# Altium schematic sheet FOTA MicroController Power Switch.SchDoc: FOTA MicroController Latched Power Trigger
size 292 x 193 mm; DocumentNumber: 44; SheetNumber: 32; SheetTotal: 42
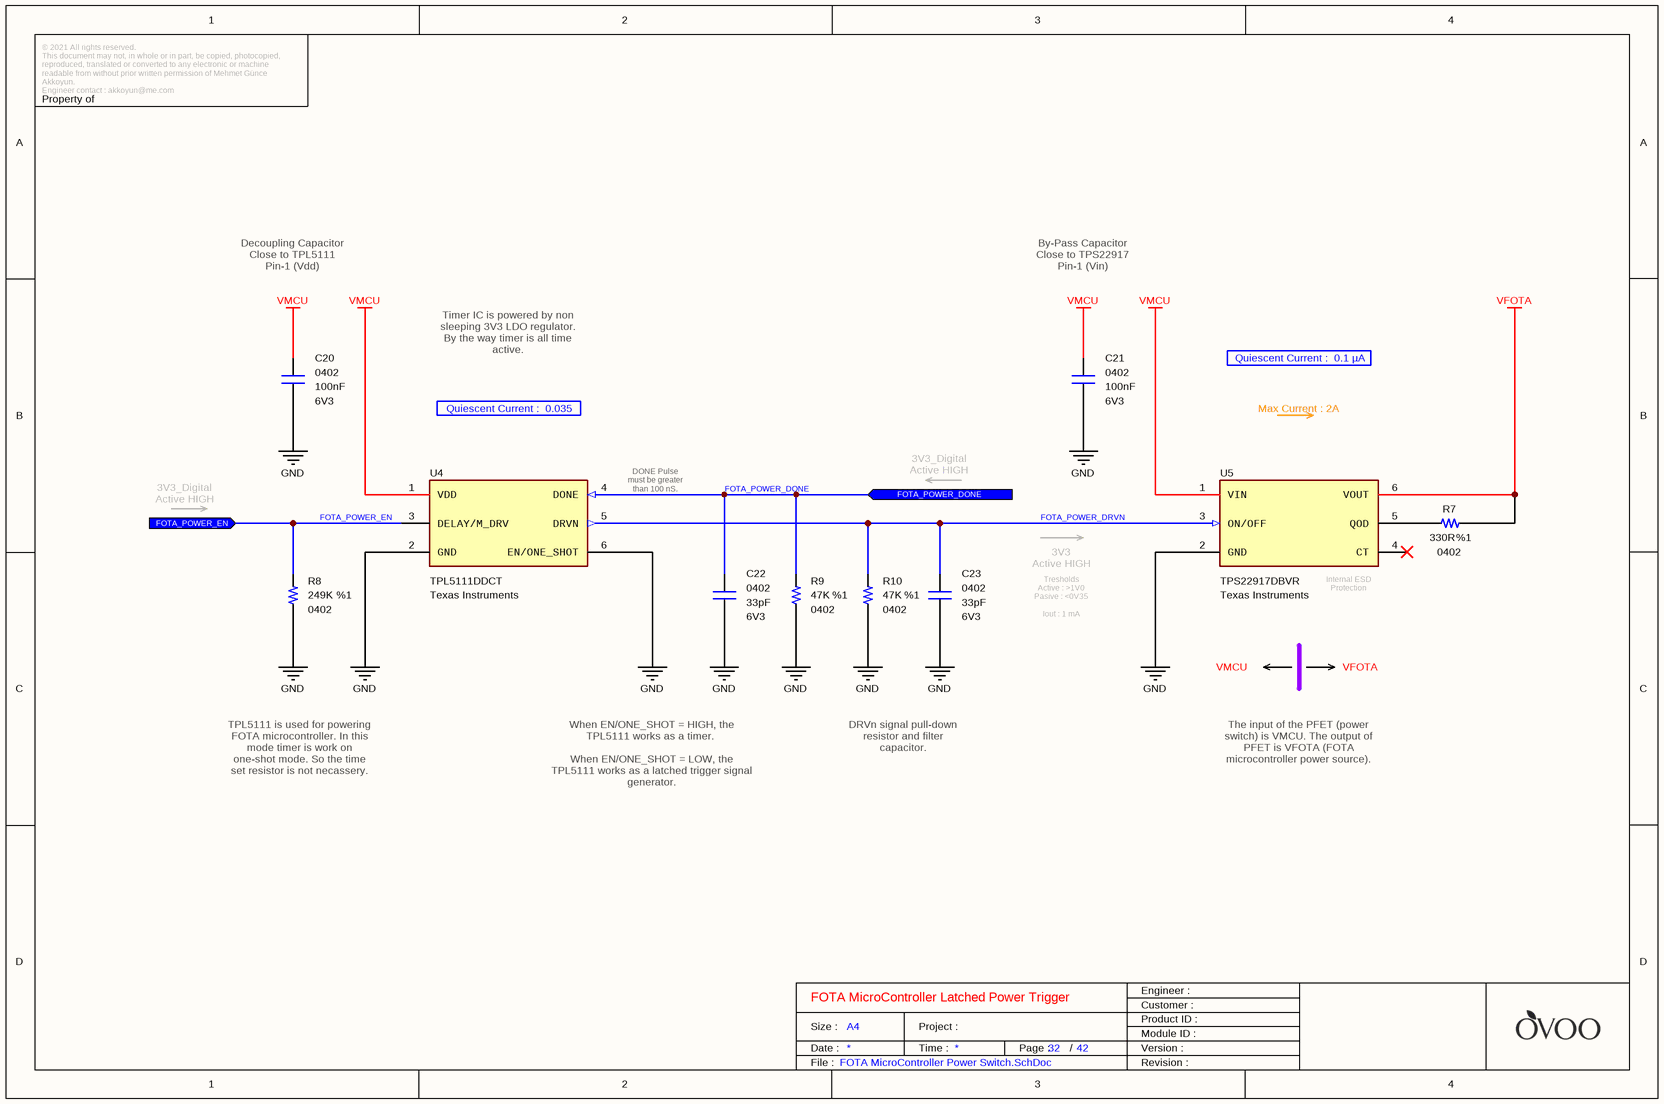
[diagram p0: FOTA MicroController Power Switch.SchDoc]

## Parts
C20  value 100nF  Case: 0402  Voltage: 6V3  [CAPACITOR_0402]  (hidden comment: Multilayer Ceramic Capacitor)
C21  value 100nF  Case: 0402  Voltage: 6V3  [CAPACITOR_0402]  (hidden comment: Multilayer Ceramic Capacitor)
C22  value 33pF  Case: 0402  Voltage: 6V3  [CAPACITOR_0402]  (hidden comment: Multilayer Ceramic Capacitor)
C23  value 33pF  Case: 0402  Voltage: 6V3  [CAPACITOR_0402]  (hidden comment: Multilayer Ceramic Capacitor)
R7  value 330R  Tolerance: %1  Case: 0402  [RESISTOR_0402]  (hidden comment: 330R - 0402 - %1 - 1/16W)
R8  value 249K  Tolerance: %1  Case: 0402  [RESISTOR_0402]  (hidden comment: Thick Film Resistor)
R9  value 47K  Tolerance: %1  Case: 0402  [RESISTOR_0402]  (hidden comment: 47K - 0402 - %1 - 1/16W)
R10  value 47K  Tolerance: %1  Case: 0402  [RESISTOR_0402]  (hidden comment: 47K - 0402 - %1 - 1/16W)
U4  Manufacturer Part Number: TPL5111DDCT  Manufacturer Name: Texas Instruments  [SOT-23-6]  (hidden comment: Nanopower Timer IC)
U5  Manufacturer Part Number: TPS22917DBVR  Manufacturer Name: Texas Instruments  [SOT-23-6]  (hidden comment: Power Switch)

## Ports
FOTA_POWER_DONE (in), FOTA_POWER_EN (in)

## Nets
GND: C20.1 C21.2 C22.1 C23.1 R8.1 R9.1 R10.1 U4.2(GND) U4.6(EN/ONE_SHOT) U5.2(GND)
VFOTA: R7.1 U5.6(VOUT)
VMCU: C20.2 C21.1 U4.1(VDD) U5.1(VIN)
FOTA_POWER_DONE: C22.2 R9.2 U4.4(DONE) ; port FOTA_POWER_DONE
FOTA_POWER_DRVN: C23.2 R10.2 U4.5(DRVN) U5.3(ON/OFF)
FOTA_POWER_EN: R8.2 U4.3(DELAY/M_DRV) ; port FOTA_POWER_EN
NetR7_2: R7.2 U5.5(QOD)

Not connected (* = marked no-connect by the designer): U5 4(CT)*

## Notes on the sheet
- Decoupling Capacitor
  Close to TPL5111
  Pin-1 (Vdd)
- By-Pass Capacitor
  Close to TPS22917
  Pin-1 (Vin)
- Quiescent Current :  0.035 µA
- Timer IC is powered by non sleeping 3V3 LDO regulator. By the way timer is all time active.
- Quiescent Current :  0.1 µA
- 3V3_Digital
  Active HIGH
- Max Current : 2A
- (near U4) DONE Pulse must be greater than 100 nS.
- Tresholds
  Active : >1V0
  Pasive : <0V35
  Iout : 1 mA
- 3V3
  Active HIGH
- (near U5) Internal ESD Protection
- VMCU
- VFOTA
- DRVn signal pull-down resistor and filter capacitor.
- TPL5111 is used for powering FOTA microcontroller. In this mode timer is work on one-shot mode. So the time set resistor is not necassery.
- When EN/ONE_SHOT = HIGH, the TPL5111 works as a timer.
  When EN/ONE_SHOT = LOW, the TPL5111 works as a latched trigger signal generator.
- The input of the PFET (power switch) is VMCU. The output of PFET is VFOTA (FOTA microcontroller power source).
- © 2021 All rights reserved.
  This document may not, in whole or in part, be copied, photocopied, reproduced, translated or converted to any electronic or machine readable from without prior written permission of Mehmet Günce Akkoyun.
  Engineer contact : akkoyun@me.com
- Property of
- Engineer :
- Date :
- Size :
- A4
- Time :
- Project :
- Page :
- /
- Customer :
- Product ID :
- Module ID :
- Version :
- File :
- Revision :

## Library data of the parts
C20 C21 = Capacitor - 100nF [0402-6V3]: Capacitor - 100nF [0402-6V3] (Ceramic); Manufacturer Name: AVX; Manufacturer Part Number: 04026D104KAT4A; Dielectric: X5R; Tolerance: %10; Height: 0.25mm; ComponentLink1Description: Mouser; ComponentLink1URL: https://www.mouser.com.tr/ProductDetail/AVX/04026D104KAT4A?qs=sGAEpiMZZMs0AnBnWHyRQPg4iYkCw7IMED%2F4kpqgf7w%3D; ComponentLink2Description: DataSheet; ComponentLink2URL: https://www.mouser.com.tr/datasheet/2/40/cx5r-776519.pdf; ROHS: Yes; Maximum Operating Temperature: +85; Minimum Operating Temperature: -55; Supplier 1: Avnet; Supplier Part Number 1: 04026D104KAT4A; Mouser Part Number: 581-04026D104KAT4A
C22 C23 = Capacitor - 33pF [0402-6V3]: Capacitor - 33pF [0402] (Ceramic); Manufacturer Name: Kemet; Manufacturer Part Number: C0402C330J9RACAUTO; Dielectric: X7R; Tolerance: 10%; Height: 0.5mm; Maximum Operating Temperature: +125; Minimum Operating Temperature: -55; ROHS: Yes; ComponentLink1Description: DataSheet; ComponentLink1URL: https://api.kemet.com/component-edge/download/datasheet/C0402C330J9RACAUTO.pdf; ComponentLink2Description: Mouser; ComponentLink2URL: https://www.mouser.com/Search/Refine.aspx?Keyword=80-C0402C330J9RAUTO; Supplier 1: Mouser; Supplier Part Number 1: 80-C0402C330J9RAUTO; Mouser Part Number: 80-C0402C330J9RAUTO
R7 = Resistor - 330R: Thick Film Resistors - SMD 1/16 W 330 Ohm 1%; Manufacturer Name: Vishay; Manufacturer Part Number: CRCW0402330RFKED; Height: 0.4mm; ComponentLink1Description: DataSheet; ComponentLink1URL: https://www.mouser.com.tr/datasheet/2/427/dcrcwe3-1762152.pdf; ComponentLink2Description: Mouser; ComponentLink2URL: https://www.mouser.com.tr/ProductDetail/Vishay-Dale/CRCW0402330RFKED?qs=sGAEpiMZZMu61qfTUdNhG2DpbjADlD3GGS6SwBlLi5Q%3D; Supplier 1: Digi-Key; Supplier 2: Digi-Key; Supplier Part Number 2: 541-330LDKR-ND; Supplier Part Number 1: 541-330LCT-ND; Mouser Part Number: 71-CRCW0402-330-E3; Supplier 3: Digi-Key; Supplier 4: Newark; Supplier 5: Newark; Supplier 6: RSComponents; Supplier 7: RSComponents; Supplier 8: Future Electronics; Supplier 9: Future Electronics; Supplier 10: Newark; Supplier 11: Newark; Supplier 12: Arrow Electronics; Supplier 13: Mouser; Supplier 14: Avnet; Supplier 15: Farnell; Supplier 16: Farnell; Supplier 17: Farnell; Supplier 18: Allied Electronics; Supplier 19: Allied Electronics; Supplier 20: Avnet; Supplier 21: Avnet; Supplier 22: Future Electronics; Supplier 23: Future Electronics; Supplier 24: Newark; Supplier 25: RSComponents; Supplier 26: RSComponents; Supplier Part Number 3: 541-330LTR-ND; Supplier Part Number 4: 52K6981; Supplier Part Number 5: 61M5301; Supplier Part Number 6: 6789178P; Supplier Part Number 7: 6789178; Supplier Part Number 9: 9848185; Supplier Part Number 8: 4103726; Supplier Part Number 10: 25AC7117; Supplier Part Number 11: 42K3473; Supplier Part Number 26: 1819488; Supplier Part Number 25: 1688408; Supplier Part Number 24: 24W2220; Supplier Part Number 23: CRCW0402330RFKED-REEL; Supplier Part Number 22: CRCW0402330RFKED-CUTT; Supplier Part Number 21: 52K6981; Supplier Part Number 20: 42K3473; Supplier Part Number 19: 70272759; Supplier Part Number 18: 70202255; Supplier Part Number 17: 1469709RL; Supplier Part Number 16: 2121540; Supplier Part Number 15: 1469709; Supplier Part Number 14: CRCW0402330RFKED; Supplier Part Number 13: 71-CRCW0402-330-E3; Supplier Part Number 12: CRCW0402330RFKED
R8 = Resistor - 249K: Thick Film Resistors - SMD 1/16 W 249 Kohms 1%; Manufacturer Name: Vishay; Manufacturer Part Number: CRCW0402249KFKED; Height: 0.35mm; ComponentLink1Description: DataSheet; ComponentLink1URL: https://www.mouser.com.tr/datasheet/2/427/dcrcwe3-1762152.pdf; ComponentLink2Description: Mouser; ComponentLink2URL: https://www.mouser.com.tr/ProductDetail/Vishay-Dale/CRCW0402249KFKED?qs=sGAEpiMZZMu61qfTUdNhG2DpbjADlD3GEiYBObatoAI%3D; Supplier 1: Mouser; Supplier 2: Digi-Key; Supplier Part Number 1: 71-CRCW0402-249K-E3; Supplier Part Number 2: 541-249KLCT-ND; Mouser Part Number: 71-CRCW0402-249K-E3
R9 R10 = Resistor - 47K: Thick Film Resistors - SMD 1/16 W 47 Kohms 1%; Manufacturer Name: Vishay; Manufacturer Part Number: CRCW040247K0FKED; Height: 0.4mm; ComponentLink1Description: DataSheet; ComponentLink1URL: https://www.mouser.com.tr/datasheet/2/427/dcrcwe3-1762152.pdf; ComponentLink2Description: Mouser; ComponentLink2URL: https://www.mouser.com.tr/ProductDetail/Vishay-Dale/CRCW040247K0FKED?qs=sGAEpiMZZMu61qfTUdNhG2DpbjADlD3GL%252B3h1elTxqU%3D; Supplier 1: RSComponents; Supplier 2: Newark; Supplier Part Number 1: 6789361P; Supplier Part Number 2: 52K7097; Supplier 3: Avnet; Supplier 4: RSComponents; Supplier 5: Future Electronics; Supplier 6: Future Electronics; Supplier 7: Newark; Supplier 8: Arrow Electronics; Supplier 9: Mouser; Supplier 10: Newark; Supplier 11: Avnet; Supplier 12: Digi-Key; Supplier 13: Digi-Key; Supplier 14: Digi-Key; Supplier 15: Newark; Supplier 16: Farnell; Supplier 17: Farnell; Supplier 18: Farnell; Supplier 19: Allied Electronics; Supplier 20: Allied Electronics; Supplier 21: Avnet; Supplier 22: Future Electronics; Supplier 23: Future Electronics; Supplier 24: Future Electronics; Supplier 25: Newark; Supplier 26: RSComponents; Supplier 27: RSComponents; Supplier Part Number 3: 52K7097; Supplier Part Number 4: 6789361; Supplier Part Number 5: 2103738; Supplier Part Number 6: 7521222; Supplier Part Number 7: 42K3500; Supplier Part Number 8: CRCW040247K0FKED; Supplier Part Number 12: 541-47.0KLCT-ND; Supplier Part Number 14: 541-47.0KLTR-ND; Supplier Part Number 10: 61M5310; Supplier Part Number 9: 71-CRCW0402-47K-E3; Supplier Part Number 13: 541-47.0KLDKR-ND; Supplier Part Number 11: CRCW040247K0FKED; Supplier Part Number 15: 25AC7165; Supplier Part Number 16: 1469719; Supplier Part Number 18: 2121814; Supplier Part Number 17: 1469719RL; Supplier Part Number 19: 70202660; Supplier Part Number 20: 70272767; Supplier Part Number 21: 42K3500; Supplier Part Number 22: 6128776; Supplier Part Number 24: CRCW040247K0FKED-REEL; Supplier Part Number 23: CRCW040247K0FKED-CUTT; Supplier Part Number 25: 24W2315; Supplier Part Number 26: 1688455; Supplier Part Number 27: 1823505
U4 = IC - TPL5111: Timers & Support Products Ultra Low Power System Timer (35 nA) for Power Gating in duty cycled applications.; Supply Voltage - Min: 1.8V; Supply Voltage - Max: 5.5V; Height: 1.1mm; ROHS: Yes; Minimum Operating Temperature: -40; Maximum Operating Temperature: +105; ComponentLink1Description: DataSheet; ComponentLink1URL: http://www.ti.com/general/docs/suppproductinfo.tsp?distId=26&gotoUrl=http%3A%2F%2Fwww.ti.com%2Flit%2Fgpn%2Ftpl5111; ComponentLink2Description: Mouser; ComponentLink2URL: https://www.mouser.com/Search/Refine.aspx?Keyword=595-TPL5111DDCT; Supplier 1: Mouser; Supplier 2: Arrow; Supplier 3: Farnell; Supplier 4: Digi-Key; Supplier 5: Newark; Supplier Part Number 1: 595-TPL5111DDCT; Supplier Part Number 2: TPL5111DDCT; Supplier Part Number 3: 3006922; Supplier Part Number 4: 296-42621-1-ND; Supplier Part Number 5: 28AH5709; Mouser Part Number: 595-TPL5111DDCT; Case: SOT-23-6
U5 = IC - TPS22917DBVR: Power Switch MosFet; Height: 1.45mm; ComponentLink1Description: DataSheet; ComponentLink1URL: http://www.ti.com/lit/gpn/tps22917; ComponentLink2Description: Mouser; ComponentLink2URL: https://www.mouser.com/Search/Refine.aspx?Keyword=595-TPS22917DBVR; Supplier 1: Mouser; Supplier 2: Digi-Key; Supplier Part Number 1: 595-TPS22917DBVR; Supplier Part Number 2: 296-50498-1-ND; Mouser Part Number: 595-TPS22917DBVR; Case: SOT-23-6